# EAGLE schematic esp-wroom-02-i2c (EAGLE 7.3.0)
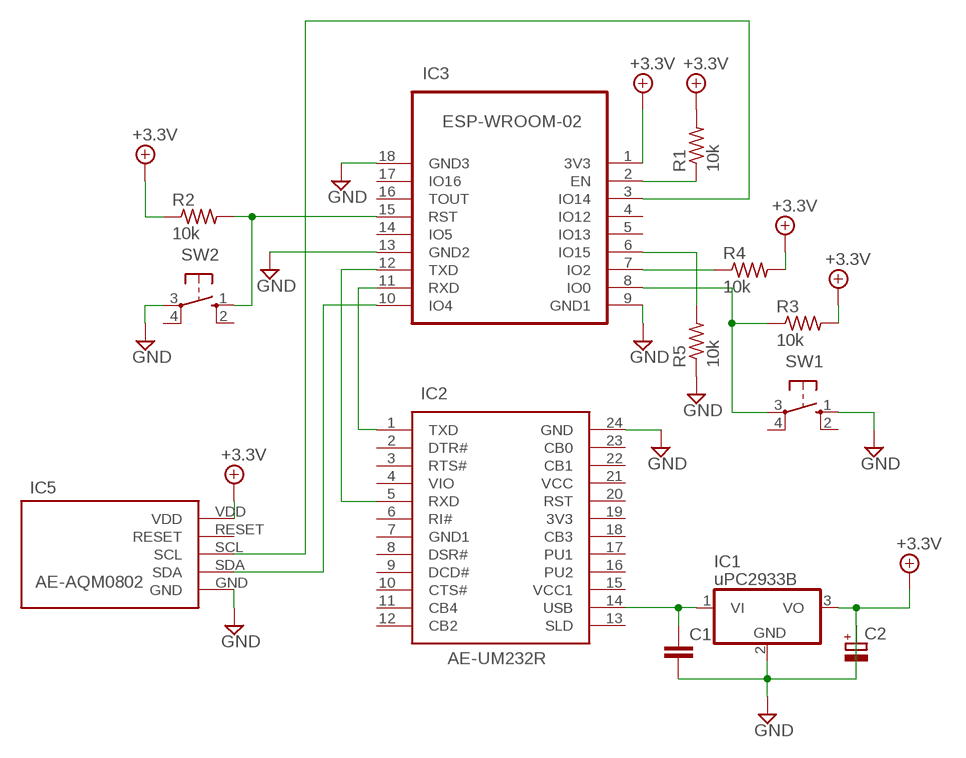
[diagram p0: schematic, sheet 1]

## Parts
C1  C-EU025-024X044  [C025-024X044]
C2  CPOL-EUE1.8-4  [E1,8-4]
IC1  uPC2933B  786TV  [TO220V]
IC2  AE-UM232R  [AE-UM232R]
IC3  ESP-WROOM-02  [ESP-WROOM-02]
IC5  AE-AQM0802  [AE-AQM0802]
R1  10k  R-US_0204/7  [0204/7]
R2  10k  R-US_0204/7  [0204/7]
R3  10k  R-US_0204/7  [0204/7]
R4  10k  R-US_0204/7  [0204/7]
R5  10k  R-US_0204/7  [0204/7]
SW1  10-XX  [B3F-10XX]
SW2  10-XX  [B3F-10XX]

## Nets
+4.1V: IC3.1(3V3) IC5.VDD R1.2 R2.1 R3.2 R4.2 ; supply symbol labelled +3.3V
GND: C1.2 C2.+ C2.- IC1.2(GND) IC1.3(VO) IC3.9(GND1) IC3.13(GND2) IC3.18(GND3) IC5.GND R5.1 SW1.1(S) SW2.3(P) ; supply symbol labelled +3.3V
N$1: IC2.24(GND) ; supply symbol labelled GND
N$2: IC2.1(TXD) IC3.11(RXD)
N$3: IC2.5(RXD) IC3.12(TXD)
N$4: IC3.2(EN) R1.1
N$5: IC3.15(RST) R2.2 SW2.1(S)
N$6: IC3.7(IO2) R4.1
N$7: IC3.8(IO0) R3.1 SW1.3(P)
N$8: IC3.6(IO15) R5.2
N$9: C1.1 IC1.1(VI) IC2.14(USB)
N$10: IC3.3(IO14) IC5.SCL
N$11: IC3.10(IO4) IC5.SDA
Unconnected: IC2.2(DTR#) IC2.3(RTS#) IC2.4(VIO) IC2.6(RI#) IC2.8(DSR#) IC2.9(DCD#) IC2.10(CTS#) IC2.11(CB4) IC2.12(CB2) IC2.13(SLD) IC2.16(PU2) IC2.17(PU1) IC2.18(CB3) IC2.19(3V3) IC2.20(RST) IC2.22(CB1) IC2.23(CB0) IC3.4(IO12) IC3.5(IO13) IC3.14(IO5) IC3.16(TOUT) IC3.17(IO16) IC5.RESET SW1.2(S1) SW1.4(P1) SW2.2(S1) SW2.4(P1)

## Power pins joined to a net without a drawn wire
GND1: IC2.7(GND1)
VCC: IC2.21(VCC)
VCC1: IC2.15(VCC1)

## Library data of the parts
C1 = rcl:C-EU: CAPACITOR, European symbol
C2 = resistor:CPOL-EU: POLARIZED CAPACITOR, European symbol
IC1 = linear:78*: Positive VOLTAGE REGULATOR Source: http://cache.national.com/ds/LM/LM78L05.pdf http://www.fairchildsemi.com/ds/LM/LM7805.pdf
IC2 = AE-UM232R:AE-UM232R: FT232RL USB-Serial Converter - AE-UM232R
IC3 = esp-wroom-02:ESP-WROOM-02: WiFi module - ESP-WROOM-02
IC5 = AE-AQM0802:AE-AQM0802: 8x2 I2C LDC Module with 0.1inch convert PCB - AE-AQM0802
R1-R5 = resistor:R-US_: RESISTOR, American symbol
SW1 SW2 = switch-omron:10-XX: OMRON SWITCH; MPN: B3F-1000; OC_FARNELL: 176432; OC_NEWARK: 36M3542